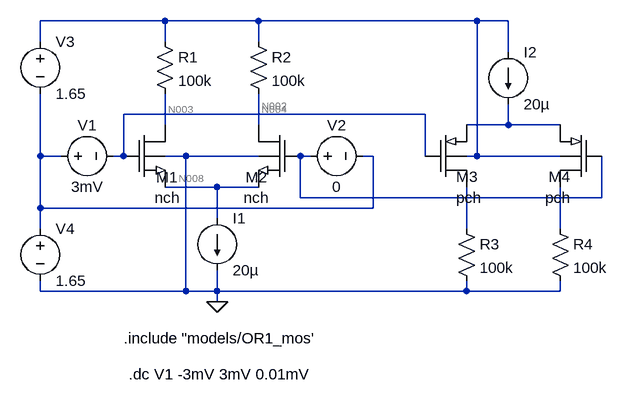
[diagram p0: schematic test (2).asc]
test (2).asc, the LTspice schematic file:
Version 4
SHEET 1 1020 680
WIRE 160 -80 -32 -80
WIRE 304 -80 160 -80
WIRE 640 -80 304 -80
WIRE 688 -80 640 -80
WIRE -32 -48 -32 -80
WIRE 160 -48 160 -80
WIRE 304 -48 304 -80
WIRE 688 -32 688 -80
WIRE 560 64 96 64
WIRE 160 80 160 32
WIRE 304 80 304 32
WIRE 688 80 688 48
WIRE 688 80 624 80
WIRE 768 80 688 80
WIRE -32 128 -32 32
WIRE 0 128 -32 128
WIRE 96 128 96 64
WIRE 96 128 80 128
WIRE 192 128 160 128
WIRE 304 128 192 128
WIRE 384 128 368 128
WIRE 480 128 464 128
WIRE 560 128 560 64
WIRE 640 128 640 -80
WIRE 640 128 624 128
WIRE 768 128 640 128
WIRE 240 176 160 176
WIRE 304 176 240 176
WIRE 368 192 368 128
WIRE 832 192 832 128
WIRE 832 192 368 192
WIRE -32 208 -32 128
WIRE 480 208 480 128
WIRE 480 208 -32 208
WIRE 240 224 240 176
WIRE -32 240 -32 208
WIRE 624 240 624 176
WIRE 768 240 768 176
WIRE -32 336 -32 320
WIRE 192 336 192 128
WIRE 192 336 -32 336
WIRE 240 336 240 304
WIRE 240 336 192 336
WIRE 624 336 624 320
WIRE 624 336 240 336
WIRE 768 336 768 320
WIRE 768 336 624 336
WIRE 240 352 240 336
FLAG 240 352 0
SYMBOL NMOS_OR1 96 128 R0
SYMATTR InstName M1
SYMATTR Value2 l=2u w=20u
SYMBOL NMOS_OR1 368 128 M0
SYMATTR InstName M2
SYMATTR Value2 l=2u w=20u
SYMBOL current 240 224 R0
WINDOW 123 0 0 Left 0
WINDOW 39 0 0 Left 0
SYMATTR InstName I1
SYMATTR Value 20µ
SYMBOL voltage -16 128 R270
WINDOW 0 32 56 VTop 2
WINDOW 3 -32 56 VBottom 2
WINDOW 123 0 0 Left 0
WINDOW 39 0 0 Left 0
SYMATTR InstName V1
SYMATTR Value 3mV
SYMBOL voltage 368 128 R270
WINDOW 0 32 56 VTop 2
WINDOW 3 -32 56 VBottom 2
SYMATTR InstName V2
SYMATTR Value 0
SYMBOL res 144 -64 R0
SYMATTR InstName R1
SYMATTR Value 100k
SYMBOL res 288 -64 R0
SYMATTR InstName R2
SYMATTR Value 100k
SYMBOL voltage -32 -64 R0
SYMATTR InstName V3
SYMATTR Value 1.65
SYMBOL voltage -32 224 R0
WINDOW 123 0 0 Left 0
WINDOW 39 0 0 Left 0
SYMATTR InstName V4
SYMATTR Value 1.65
SYMBOL PMOS_OR1 560 128 R0
SYMATTR InstName M3
SYMATTR Value2 l=2u w=20u
SYMBOL PMOS_OR1 832 128 M0
SYMATTR InstName M4
SYMATTR Value2 l=2u w=20u
SYMBOL current 688 -32 R0
WINDOW 123 0 0 Left 0
WINDOW 39 0 0 Left 0
SYMATTR InstName I2
SYMATTR Value 20µ
SYMBOL res 608 224 R0
SYMATTR InstName R3
SYMATTR Value 100k
SYMBOL res 752 224 R0
SYMATTR InstName R4
SYMATTR Value 100k
TEXT 96 408 Left 2 !.include "models/OR1_mos'
TEXT 104 464 Left 2 !.dc V1 -3mV 3mV 0.01mV

The netlist it stands for:
* test (2).asc
M1 N003 N002 N008 0 nch l=2u w=20u
M2 N004 N007 N008 0 nch l=2u w=20u
I1 N008 0 20µ
V1 N006 N002 3mV
V2 N007 N006 0
R1 N001 N003 100k
R2 N001 N004 100k
V3 N001 N006 1.65
V4 N006 0 1.65
M3 N009 N002 N005 N001 pch l=2u w=20u
M4 N010 N007 N005 N001 pch l=2u w=20u
I2 N001 N005 20µ
R3 N009 0 100k
R4 N010 0 100k
.model NMOS NMOS
.model PMOS PMOS
.lib standard.mos
.include "models/OR1_mos'
.dc V1 -3mV 3mV 0.01mV
.backanno
.end

* Results of the author's LTspice run, read from the files saved beside the schematic
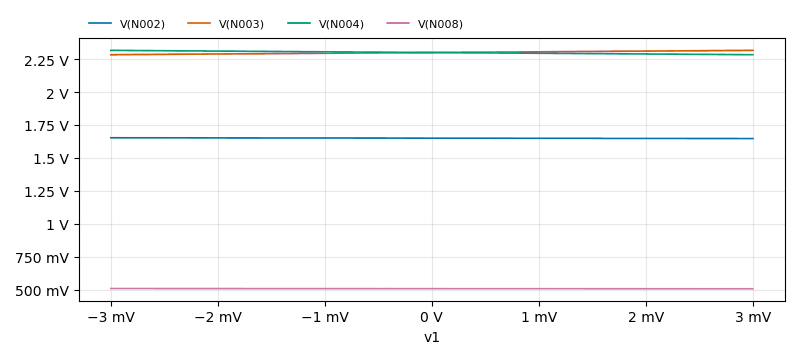
[diagram p1: DC transfer characteristic of test (2).asc, plotted from the saved traces]
* DC transfer characteristic, 1 run:
*   V(N002): 1.653 V at v1=-3 mV, 1.647 V at v1=3 mV, min 1.647 V, max 1.653 V
*   V(N003): 2.283 V at v1=-3 mV, 2.317 V at v1=3 mV, min 2.283 V, max 2.317 V
*   V(N004): 2.317 V at v1=-3 mV, 2.283 V at v1=3 mV, min 2.283 V, max 2.317 V
*   V(N008): 508.5 mV at v1=-3 mV, 506.3 mV at v1=3 mV, min 506.3 mV, max 508.5 mV